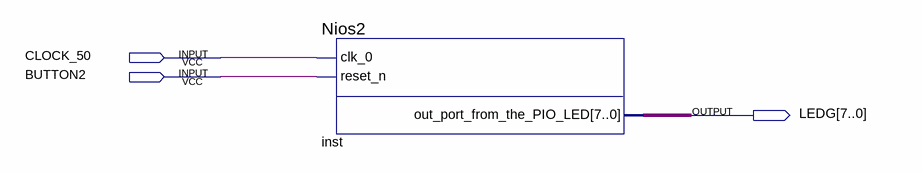
[diagram p0: schematic sheet]
// Quartus schematic Nios2_top.bdf as structural Verilog: 1 symbols, 3 pins
module Nios2_top (
  input  CLOCK_50,
  input  BUTTON2,
  output [7:0] LEDG
);

  Nios2 inst (.clk_0(CLOCK_50), .reset_n(BUTTON2), .out_port_from_the_PIO_LED(LEDG));
endmodule
